# Altium schematic sheet RP2350_MCU.SchDoc: RP2530 Micro
size Letter; Organization: NewAE Technology Inc.; Address1: 1083 Queen St., Suite 196; Address2: Halifax; Address3: NS; Address4: Canada B3H 0B2; DocumentNumber: .; Revision: .; SheetNumber: 1; SheetTotal: 4; SheetApproved: NO
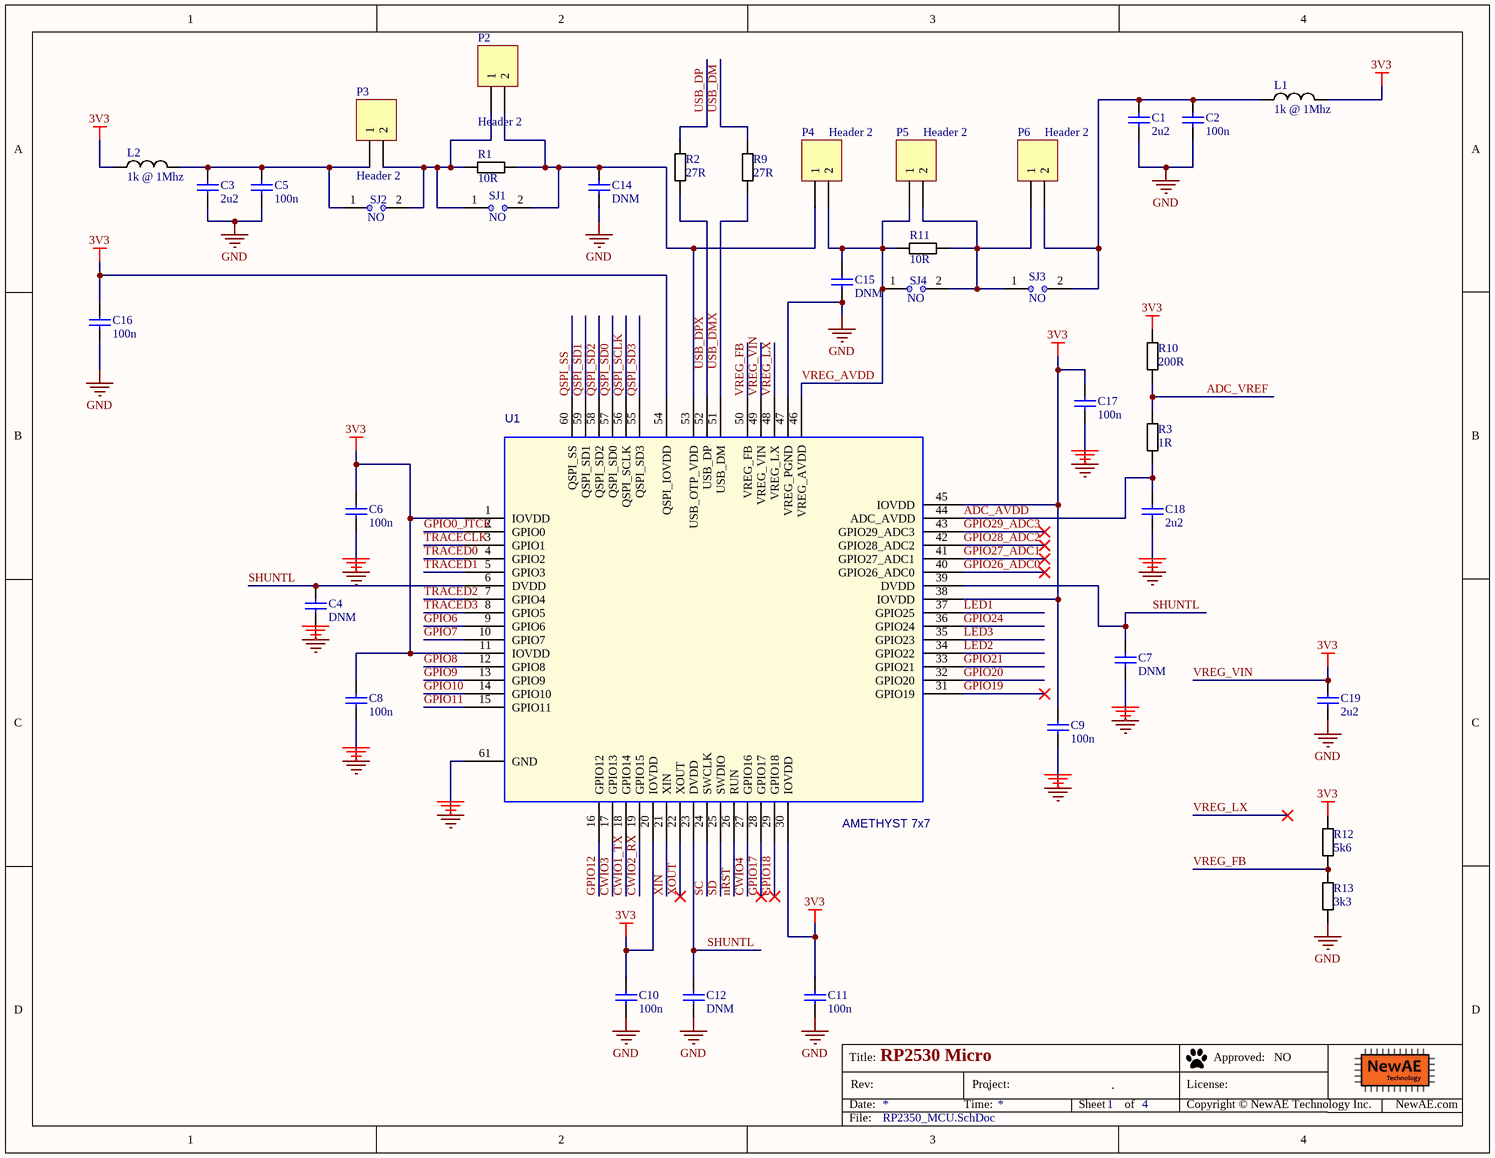
[diagram p0: RP2350_MCU.SchDoc]

## Parts
C1  2u2  [CAPC0603_M]
C2  100n  [CAPC0402_M]
C3  2u2  [CAPC0603_M]
C4  DNM  [CAPC0603_M]
C5  100n  [CAPC0402_M]
C6  100n  [CAPC0402_M]
C7  DNM  [CAPC0603_M]
C8  100n  [CAPC0402_M]
C9  100n  [CAPC0402_M]
C10  100n  [CAPC0402_M]
C11  100n  [CAPC0402_M]
C12  DNM  [CAPC0603_M]
C14  DNM  [CAPC0603_M]
C15  DNM  [CAPC0603_M]
C16  100n  [CAPC0402_M]
C17  100n  [CAPC0402_M]
C18  2u2  [CAPC0603_M]
C19  2u2  [CAPC0603_M]
L1  1k @ 1Mhz  [IND_0603]
L2  1k @ 1Mhz  [IND_0603]
P2  Header 2  [HDR1X2]
P3  Header 2  [HDR1X2]
P4  Header 2  [HDR1X2]
P5  Header 2  [HDR1X2]
P6  Header 2  [HDR1X2]
R1  10R  [RESC1608X55N]
R2  27R  [RESC1608X55N]
R3  1R  [RESC1608X55N]
R9  27R  [RESC1608X55N]
R10  200R  [RESC1608X55N]
R11  10R  [RESC1608X55N]
R12  5k6  [RESC1608X55N]
R13  3k3  [RESC1608X55N]
SJ1  NO  [SJ_2S_NO]  (no BOM)
SJ2  NO  [SJ_2S_NO]  (no BOM)
SJ3  NO  [SJ_2S_NO]  (no BOM)
SJ4  NO  [SJ_2S_NO]  (no BOM)
U1  AMETHYST 7x7  [QFN60P700X700X85_HS-61M]

## Nets
GND: C1.2 C2.2 C3.2 C4.2 C5.2 C6.2 C7.2 C8.2 C9.2 C10.2 C11.2 C12.2 C14.2 C15.2 C16.2 C17.2 C18.2 C19.2 R13.2 U1.47(VREG_PGND) U1.61(GND)
VREG_VIN: C6.1 C8.1 C9.1 C10.1 C11.1 C16.1 C17.1 C19.1 L1.2 L2.1 R10.1 R12.1 U1.1(IOVDD) U1.11(IOVDD) U1.20(IOVDD) U1.30(IOVDD) U1.38(IOVDD) U1.45(IOVDD) U1.49(VREG_VIN) U1.54(QSPI_IOVDD)  [also labelled 3V3]
ADC_AVDD: C18.1 R3.1 U1.44(ADC_AVDD)
ADC_VREF: R3.2 R10.2
CWIO1_TX: U1.18(GPIO14)
CWIO2_RX: U1.19(GPIO15)
CWIO3: U1.17(GPIO13)
CWIO4: U1.27(GPIO16)
GPIO0_JTCK: U1.2(GPIO0)
GPIO6: U1.9(GPIO6)
GPIO7: U1.10(GPIO7)
GPIO8: U1.12(GPIO8)
GPIO9: U1.13(GPIO9)
GPIO10: U1.14(GPIO10)
GPIO11: U1.15(GPIO11)
GPIO12: U1.16(GPIO12)
GPIO17: U1.28(GPIO17)
GPIO18: U1.29(GPIO18)
GPIO19: U1.31(GPIO19)
GPIO20: U1.32(GPIO20)
GPIO21: U1.33(GPIO21)
GPIO24: U1.36(GPIO24)
GPIO26_ADC0: U1.40(GPIO26_ADC0)
GPIO27_ADC1: U1.41(GPIO27_ADC1)
GPIO28_ADC2: U1.42(GPIO28_ADC2)
GPIO29_ADC3: U1.43(GPIO29_ADC3)
LED1: U1.37(GPIO25)
LED2: U1.34(GPIO22)
LED3: U1.35(GPIO23)
nRST: U1.26(RUN)
QSPI_SCLK: U1.56(QSPI_SCLK)
QSPI_SD0: U1.57(QSPI_SD0)
QSPI_SD1: U1.59(QSPI_SD1)
QSPI_SD2: U1.58(QSPI_SD2)
QSPI_SD3: U1.55(QSPI_SD3)
QSPI_SS: U1.60(QSPI_SS)
SC: U1.24(SWCLK)
SD: U1.25(SWDIO)
SHUNTL: C4.1 C7.1 C12.1 U1.6(DVDD) U1.23(DVDD) U1.39(DVDD)
TRACECLK: U1.3(GPIO1)
TRACED0: U1.4(GPIO2)
TRACED1: U1.5(GPIO3)
TRACED2: U1.7(GPIO4)
TRACED3: U1.8(GPIO5)
USB_DM: R9.2
USB_DMX: R9.1 U1.51(USB_DM)
USB_DP: R2.2
USB_DPX: R2.1 U1.52(USB_DP)
VREG_AVDD: C15.1 P4.2 P5.1 R11.1 SJ4.1 U1.46(VREG_AVDD)
VREG_FB: R12.2 R13.1 U1.50(VREG_FB)
VREG_LX: U1.48(VREG_LX)
XIN: U1.21(XIN)
XOUT: U1.22(XOUT)
NetC1_1: C1.1 C2.1 L1.1 P6.2 SJ3.2
NetC3_1: C3.1 C5.1 L2.2 P3.1 SJ2.1
NetC14_1: C14.1 P2.2 P4.1 R1.2 SJ1.2 U1.53(USB_OTP_VDD)
NetP2_1: P2.1 P3.2 R1.1 SJ1.1 SJ2.2
NetP5_2: P5.2 P6.1 R11.2 SJ3.1 SJ4.2

## Notes on the sheet
- Title:
- Date:
- Rev:
- Time:
- Project:
- Sheet
- of
- License:
- Copyright © NewAE Technology Inc.
- Approved:
- NewAE.com
- File:

## Library data of the parts
C1 C3 C18 C19 = CCHIP-2u2-0603: 2u2, 0603; Manufacture 1: Samsung; Manufacture Part Number 1: CL10B225KP8NNNC; Component Group: Capacitor; Case-EIA: 0603; Case-Metric: 1608; Rated Voltage: 10VDC; Part Number: CCHIP-2u2-0603; Footprint: 0603; Pin Count: 2; Supplier 1: Digi-Key; Supplier Part Number 1: 1276-1134-1-ND; Value: 2u2; Mounting Technology: SMT; Component Kind: Standard; Component Type: Standard
C2 C5 C6 C8-C11 C16 C17 = CCHIP-100n-0402: 100n, 0402; Manufacture Part Number 1: CGA2B3X7R1V104K050BB; Component Group: Capacitor; Case-EIA: 0402; Part Number: CCHIP-100n-0402; Footprint: 0402; Pin Count: 2; Supplier 1: Digi-Key; Supplier Part Number 1: 445-6901-1-ND; Value: 100n; Mounting Technology: SMT; Component Kind: Standard; Component Type: Standard
C4 C7 C12 C14 C15 = CCHIP-DNM-0603: DNM, 0603; Component Group: Capacitor; Case-EIA: 0603; Part Number: CCHIP-DNM-0603; Footprint: 0603; Pin Count: 2; Value: DNM; Mounting Technology: SMT; Component Kind: Standard; Component Type: Standard
L1 L2 = FBCHIP-1k-0603: Ferrite Beads HI CUR CHIP BD 0603 1000OHMS 25%; Manufacture 1: Taiyo Yuden; Manufacture Part Number 1: FBMH1608HM102-T / FBMH1608HM102-T / FBMH1608HM102-T / FBMH1608HM102-T; Component Group: Inductor; PP Material Stack: 0; Part Number: FBCHIP-1k-0603; Footprint: 0603; Pin Count: 2; Supplier 1: Mouser; Supplier Part Number 1: 963-FBMH1608HM102-T; Mounting Technology: SMT; RoHS: Yes; Component Kind: Standard; Component Type: Standard; PP Rotation: 0
P2-P6 = Header 2: Header, 2-Pin; LatestRevisionDate: 17-Jul-2002; LatestRevisionNote: Re-released for DXP Platform.; Publisher: Altium Limited
R1 R11 = RCHIP-10R-0603: 10R res, 0603, 1%, 1/10W; Manufacture 1: Yageo; Manufacture Part Number 1: RC0603FR-0710RL; Component Group: Resistor; Case-EIA: 0603; Case-Metric: 1608; Rated Power: 0.1W; Rated Voltage: 75VDC; Part Number: RCHIP-10R-0603; Footprint: 0603; Pin Count: 2; Supplier 1: Digi-Key; Supplier Part Number 1: 311-10.0HRCT-ND; Value: 10R; Tolerance: 1%; Mounting Technology: SMT; Temperature Range: -55C to 155C; Component Kind: Standard; Component Type: Standard
R2 R9 = RCHIP-27R-0603: 27R res, 0603, 1%, 1/10W; Manufacture 1: Yageo; Manufacture Part Number 1: RC0603FR-0727RL; Component Group: Resistor; Case-EIA: 0603; Case-Metric: 1608; Rated Power: 0.1W; Rated Voltage: 75VDC; Part Number: RCHIP-27R-0603; Footprint: 0603; Pin Count: 2; Supplier 1: Digi-Key; Supplier Part Number 1: 311-27.0HRCT-ND; Value: 27R; Tolerance: 1%; Mounting Technology: SMT; Temperature Range: -55C to 155C; Component Kind: Standard; Component Type: Standard
R3 = RCHIP-10R-0603: 1R res, 0603, 1%, 1/10W; Manufacture 1: Yageo; Manufacture Part Number 1: RC0603FR-0710RL; Component Group: Resistor; Value: 10R; Case-EIA: 0603; Case-Metric: 1608; Rated Power: 0.1W; Rated Voltage: 75VDC; Part Number: RCHIP-10R-0603; Footprint: 0603; Pin Count: 2; Supplier 1: Digi-Key; Supplier Part Number 1: 311-10.0HRCT-ND; Tolerance: 1%; Mounting Technology: SMT; Temperature Range: -55C to 155C; Component Kind: Standard; Component Type: Standard
R10 = RCHIP-200R-0603: 200R res, 0603, 1%, 1/10W; Manufacture 1: Yageo; Manufacture Part Number 1: RC0603FR-07200RL; Component Group: Resistor; Case-EIA: 0603; Case-Metric: 1608; Rated Power: 0.1W; Rated Voltage: 75VDC; Part Number: RCHIP-200R-0603; Footprint: 0603; Pin Count: 2; Supplier 1: Digi-Key; Supplier Part Number 1: 311-200HRCT-ND; Value: 200R; Tolerance: 1%; Mounting Technology: SMT; Temperature Range: -55C to 155C; Component Kind: Standard; Component Type: Standard
R12 = RCHIP-5k6-0603: 5k6 res, 0603, 1%, 1/10W; Manufacture 1: Yageo; Manufacture Part Number 1: RC0603FR-075K6L; Component Group: Resistor; Case-EIA: 0603; Case-Metric: 1608; Rated Power: 0.1W; Rated Voltage: 75VDC; Part Number: RCHIP-5K6-0603; Footprint: 0603; Pin Count: 2; Mounting Technology: SMT; Component Kind: Standard; Component Type: Standard; Supplier 1: Digi-Key; Supplier Part Number 1: 311-5.60KHRCT-ND; Value: 5k6; Tolerance: 1%; Temperature Range: -55C to 155C
R13 = RCHIP-3k3-0603: 3k3 res, 0603, 1%, 1/10W; Manufacture 1: Yageo; Manufacture Part Number 1: RC0603FR-073K3L; Component Group: Resistor; Case-EIA: 0603; Case-Metric: 1608; Rated Power: 0.1W; Rated Voltage: 75VDC; Part Number: RCHIP-3K3-0603; Footprint: 0603; Pin Count: 2; Mounting Technology: SMT; Component Kind: Standard; Component Type: Standard; Supplier 1: Digi-Key; Supplier Part Number 1: 311-3.30KHRCT-ND; Value: 3k3; Tolerance: 1%; Temperature Range: -55C to 155C
SJ1-SJ4 = SJ_2S_NO: Solder Jumper, NO; Component Group: PCB Feature; Part Number: SJ_2S_NO; Pin Count: 2; Mounting Technology: COPPER; Component Type: Standard (No BOM)
U1 = RPI_AMETHYST-7X7: Part Reference: U1; PCB Footprint: rpi-amethyst-7x7qfn; Value: AMETHYST 7x7